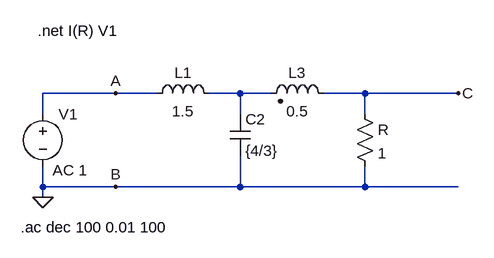
[diagram p0: schematic Ejercicio2.asc]
Ejercicio2.asc, the LTspice schematic file:
Version 4
SHEET 1 880 680
WIRE -32 112 -144 112
WIRE 32 112 -32 112
WIRE 160 112 112 112
WIRE 208 112 160 112
WIRE 352 112 288 112
WIRE 496 112 352 112
WIRE -144 144 -144 112
WIRE 160 144 160 112
WIRE 352 144 352 112
WIRE -144 256 -144 224
WIRE -32 256 -144 256
WIRE 160 256 160 208
WIRE 160 256 -32 256
WIRE 352 256 352 224
WIRE 352 256 160 256
WIRE 496 256 352 256
WIRE -144 272 -144 256
FLAG -144 272 0
FLAG -32 112 A
FLAG -32 256 B
FLAG 496 112 C
SYMBOL voltage -144 128 R0
WINDOW 123 15 102 Left 2
WINDOW 39 0 0 Left 0
SYMATTR InstName V1
SYMATTR Value ""
SYMATTR Value2 AC 1
SYMBOL ind 128 128 M270
WINDOW 0 32 56 VTop 2
WINDOW 3 4 56 VBottom 2
SYMATTR InstName L1
SYMATTR Value 1.5
SYMBOL ind2 304 128 M270
WINDOW 0 32 56 VTop 2
WINDOW 3 4 56 VBottom 2
SYMATTR InstName L3
SYMATTR Value 0.5
SYMATTR Type ind
SYMBOL res 336 128 R0
SYMATTR InstName R
SYMATTR Value 1
SYMBOL cap 144 144 R0
SYMATTR InstName C2
SYMATTR Value {4/3}
TEXT -152 16 Left 2 !.net I(R) V1
TEXT -178 318 Left 2 !.ac dec 100 0.01 100

The netlist it stands for:
* Ejercicio2.asc
V1 A 0 AC 1
L1 N001 A 1.5
L3 C N001 0.5
R C 0 1
C2 N001 0 {4/3}
.net I(R) V1
.ac dec 100 0.01 100
.backanno
.end